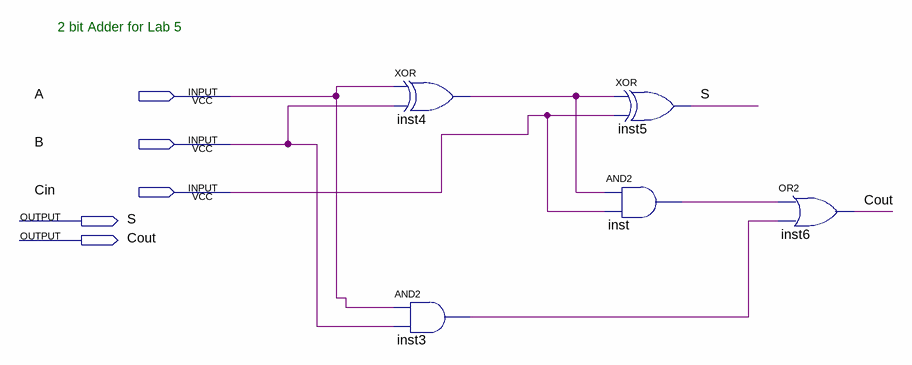
[diagram p0: schematic sheet]
// Quartus schematic adder.bdf as structural Verilog: 5 symbols, 5 pins
module adder (
  input  A,
  input  B,
  input  Cin,
  output S,
  output Cout
);

  wire inst3_out, inst4_out, inst_out;

  xor inst4 (inst4_out, A, B);
  and inst3 (inst3_out, A, B);
  xor inst5 (S, inst4_out, Cin);
  and inst (inst_out, inst4_out, Cin);
  or inst6 (Cout, inst_out, inst3_out);

  // Notes on the sheet:
  //   2 bit Adder for Lab 5
endmodule
